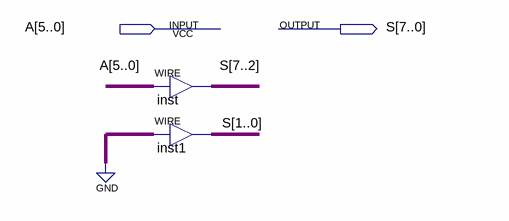
[diagram p0: schematic sheet]
// Quartus schematic g27_6bit_shift_2left.bdf as structural Verilog: 2 symbols, 2 pins
module g27_6bit_shift_2left (
  input  [5:0] A,
  output [7:0] S
);

  assign S[7:2] = A;  // WIRE inst
  assign S[1:0] = 2'b00;  // WIRE inst1
endmodule
